# EAGLE design doorbellUSB (EAGLE 9.6.2)
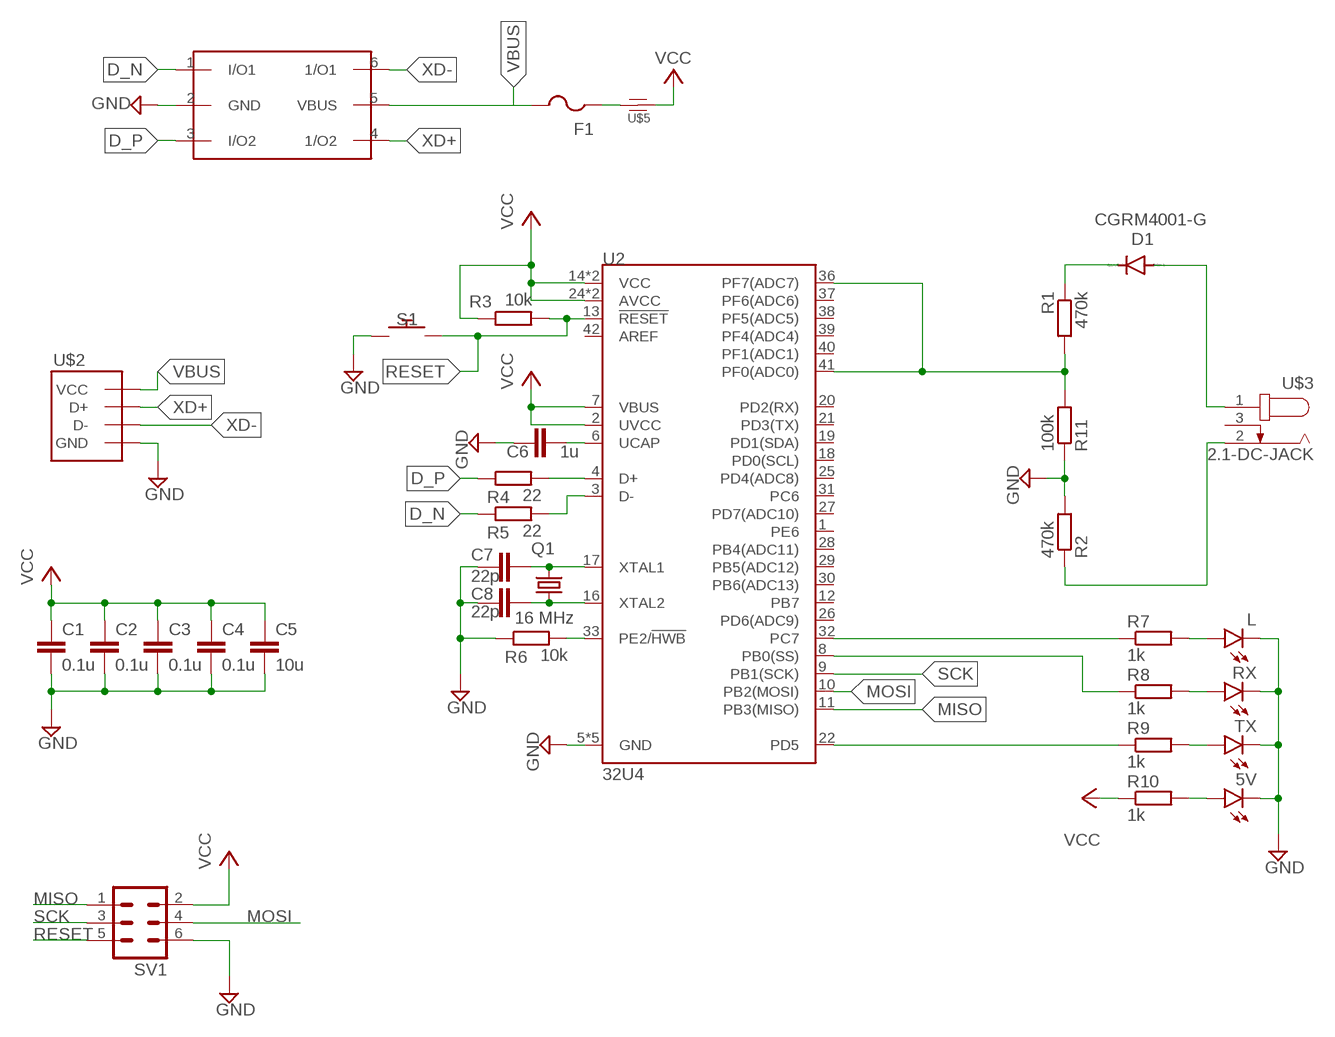
[diagram p0: schematic, sheet 1]

## Parts
5V  LEDCHIP-LED0805  [CHIP-LED0805]
C1  0.1u  C-EUC0805  [C0805]
C2  0.1u  C-EUC0805  [C0805]
C3  0.1u  C-EUC0805  [C0805]
C4  0.1u  C-EUC0805  [C0805]
C5  10u  C-EUC0805  [C0805]
C6  1u  C-EUC0805  [C0805]
C7  22p  C-EUC0805  [C0805]
C8  22p  C-EUC0805  [C0805]
D1  CGRM4001-G  [SOD-123_MINI-SMA]
F1  PTCFUSE-1812  [1812]
L  LEDCHIP-LED0805  [CHIP-LED0805]
Q1  16 MHz  KX-9B  [5.0X3.2_2]
R1  470k  R-EU_R0805  [R0805]
R2  470k  R-EU_R0805  [R0805]
R3  10k  R-EU_R0805  [R0805]
R4  22  R-EU_R0805  [R0805]
R5  22  R-EU_R0805  [R0805]
R6  10k  R-EU_R0805  [R0805]
R7  1k  R-EU_R0805  [R0805]
R8  1k  R-EU_R0805  [R0805]
R9  1k  R-EU_R0805  [R0805]
R10  1k  R-EU_R0805  [R0805]
R11  100k  R-EU_R0805  [R0805]
RX  LEDCHIP-LED0805  [CHIP-LED0805]
S1  3X4MM-PUHSBUTTON  [3X4MM-PUSHBUTTON]
SV1  MA03-2  [MA03-2]
TX  LEDCHIP-LED0805  [CHIP-LED0805]
U2  32U4  ATMEGA32U4TQFP-44  [TQFP44]
U$1  USBLC-2  [SOT23-6L]
U$2  PCB-USB-A  [USB-A-ONBOARD]
U$3  2.1-DC-JACK  [2.1X5.5MM_JACK]
U$5  FERRITE-BEAD  [R0805]

## Nets
D_N: R5.1 U$1.1(I/O1)
D_P: R4.1 U$1.3(I/O2)
DATA_N [diff pairs]: R5.2 U2.3(D-)
DATA_P [diff pairs]: R4.2 U2.4(D+)
GND: 5V.C C1.2 C2.2 C3.2 C4.2 C5.2 C6.1 C7.2 C8.2 L.C R2.2 R6.1 R11.1 RX.C S1.P$1 SV1.6 TX.C U2.5(GND) U2.15(GND) U2.23(GND) U2.35(GND) U2.43(GND) U$1.2(GND) U$2.GND
MISO: SV1.1 U2.11(PB3(MISO))
MOSI: SV1.4 U2.10(PB2(MOSI))
N$1: R2.1 U$3.2
N$2: D1.A U$3.1
N$3: D1.C R1.1
N$4: R1.2 R11.2 U2.36(PF7(ADC7)) U2.41(PF0(ADC0))
N$24: R8.1 U2.8(PB0(SS))
N$25: C6.2 U2.6(UCAP)
N$26: R9.1 U2.22(PD5)
N$27: R7.1 U2.32(PC7)
N$28: L.A R7.2
N$29: R9.2 TX.A
N$30: R6.2 U2.33(PE2/!HWB)
N$31: F1.1 U$5.2
N$32: R8.2 RX.A
N$33: 5V.A R10.2
RESET: R3.2 S1.P$2 SV1.5 U2.13(!RESET)
SCK: SV1.3 U2.9(PB1(SCK))
VBUS: F1.2 U$1.5(VBUS) U$2.VCC
VCC: C1.1 C2.1 C3.1 C4.1 C5.1 R3.1 R10.1 SV1.2 U2.2(UVCC) U2.7(VBUS) U2.14(VCC) U2.24(AVCC) U2.34(VCC) U2.44(AVCC) U$5.1
XD+ [diff pairs]: U$1.4(1/O2) U$2.D+
XD- [diff pairs]: U$1.6(1/O1) U$2.D-
XTAL_1: C8.1 Q1.1 U2.16(XTAL2)
XTAL_2: C7.1 Q1.2 U2.17(XTAL1)
Unconnected: U2.1(PE6) U2.12(PB7) U2.18(PD0(SCL)) U2.19(PD1(SDA)) U2.20(PD2(RX)) U2.21(PD3(TX)) U2.25(PD4(ADC8)) U2.26(PD6(ADC9)) U2.27(PD7(ADC10)) U2.28(PB4(ADC11)) U2.29(PB5(ADC12)) U2.30(PB6(ADC13)) U2.31(PC6) U2.37(PF6(ADC6)) U2.38(PF5(ADC5)) U2.39(PF4(ADC4)) U2.40(PF1(ADC1)) U2.42(AREF) U$3.3

## Library data of the parts
5V L RX TX = led:LED: LED OSRAM: - CHIPLED LG R971, LG N971, LY N971, LG Q971, LY Q971, LO R971, LY R971 LH N974, LH R974 LS Q976, LO Q976, LY Q976 LO Q996 - Hyper CHIPLED LW Q18S LB Q993, LB Q99A, LB R99A - SideLED LS A670, LO A670, LY A670, LG A670, LP A670 LB A673, LV A673, LT A673, LW A673 LH A674 LY A675 LS A676, LA A676, LO A676, LY A676, LW A676 LS A679, LY A679, LG A679 - Hyper Micro SIDELED® LS Y876, LA Y876, LO Y876, LY Y876 LT Y87S - SmartLED LW L88C, LW L88S LB L89C, LB L89S, LG L890 LS L89K, LO L89K, LY L89K LS L896, LA L896, LO L896, LY L896 - TOPLED LS T670, LO T670, LY T670, LG T670, LP T670 LSG T670, LSP T670, LSY T670, LOP T670, LYG T670 LG T671, LOG T671, LSG T671 LB T673, LV T673, LT T673, LW T673 LH T674 LS T676, LA T676, LO T676, LY T676, LB T676, LH T676, LSB T676, LW T676 LB T67C, LV T67C, LT T67C, LS T67K, LO T67K, LY T67K, LW E67C LS E67B, LA E67B, LO E67B, LY E67B, LB E67C, LV E67C, LT E67C LW T67C LS T679, LY T679, LG T679 LS T770, LO T770, LY T770, LG T770, LP T770 LB T773, LV T773, LT T773, LW T773 LH T774 LS E675, LA E675, LY E675, LS T675 LS T776, LA T776, LO T776, LY T776, LB T776 LHGB T686 LT T68C, LB T68C - Hyper Mini TOPLED® LB M676 - Mini TOPLED Santana® LG M470 LS M47K, LO M47K, LY M47K Source: http://www.osram.convergy.de LUXEON: - LUMILED® LXK2-PW12-R00, LXK2-PW12-S00, LXK2-PW14-U00, LXK2-PW14-V00 LXK2-PM12-R00, LXK2-PM12-S00, LXK2-PM14-U00 LXK2-PE12-Q00, LXK2-PE12-R00, LXK2-PE12-S00, LXK2-PE14-T00, LXK2-PE14-U00 LXK2-PB12-K00, LXK2-PB12-L00, LXK2-PB12-M00, LXK2-PB14-N00, LXK2-PB14-P00, LXK2-PB14-Q00 LXK2-PR12-L00, LXK2-PR12-M00, LXK2-PR14-Q00, LXK2-PR14-R00 LXK2-PD12-Q00, LXK2-PD12-R00, LXK2-PD12-S00 LXK2-PH12-R00, LXK2-PH12-S00 LXK2-PL12-P00, LXK2-PL12-Q00, LXK2-PL12-R00 Source: www.luxeon.com KINGBRIGHT: KA-3528ASYC Source: www.kingbright.com
C1-C8 = rcl:C-EU: CAPACITOR, European symbol; SPICEPREFIX: C
D1 = diode:CGRM400*-G: Molded plasitc,JEDEC SOD-123/Mini SMA Source: Comchip CGRM4001-G.pdf
F1 = adafruit:PTCFUSE: PTC fuses, resettable thermistors
Q1 = crystal-geyer_V1_0:KX: Quartz Crystals (MHz) SMD: KX - Serie Model Size l/w/h [mm] Frequency Range Frequency Stability Temp. Range [°C] Load Capacitance AECQ 200 availabel Datasheet KX-4 KX-5 KX-6 KX-7 KX-9A KX-9B KX-12A KX-12B KX-13 KX-20 KX-K KX-KS 1.6/1.2/0.3 2.0/1.6/0.45 2.5/2.0/0.55 3.2/2.5/0.8 5.0/3.2/1.0 5.0/3.2/1.1 6.0/3.5/1.1 6.0/3.5/1.0 7.0/5.0 /1.3 11.6/5.5/1.6 12.3/4.5/4.2 12.3/4.5/3.2 24.0 ~ 80.0 MHz 16.0 ~ 80.0 MHz 12.0 ~ 80.0 MHz 8.0 ~ 60.0 MHz 7,68 ~ 300,0 MHz 8,0 ~ 50,0 MHz 8,0 ~ 150,0 MHz 8,0 ~ 50,0 MHz 6,0 ~ 160,0 MHz 3,579 ~ 25,0 MHz 3,579 ~ 70,0 MHz 3,579 ~ 70,0 MHz ±10 … ±50ppm ±10 … ±50ppm ±10 … ±50ppm ±10 … ±50ppm ±10 … ±50ppm ±10 … ±50ppm ±10 … ±50ppm ±10 … ±50ppm ±10 … ±50ppm ±50ppm ±10 … ±50ppm ±10 … ±50ppm (*) -40°C …+85°C (*) -40°C …+125°C (*) -40°C …+125°C (*) -40°C …+125°C (*) -40°C …+105°C (*) -40°C …+105°C (*) -40°C …+125°C (*) -40°C …+105°C (*) -40°C …+105°C (*) -40°C …+105°C (*) -40°C …+85°C (*) -40°C …+85°C 8, 8…16 8, 8…16 10, 8…16 12, 7…20 16, 10…20 16, 10…20 16, 10…20 16, 12…20 16, 12…20 16, 12…20 16, 12…30 16, 12…30 - yes yes yes - - - - - - - - KX-4.pdf <http://www.geyer-electronic.de/uploads/tx_userartikelfrequenz/GEYER-KX-4.pdf> KX-5.pdf <http://www.geyer-electronic.de/uploads/tx_userartikelfrequenz/GEYER-KX-5.pdf> KX-6.pdf <http://www.geyer-electronic.de/uploads/tx_userartikelfrequenz/GEYER-KX-6.pdf> KX-7.pdf <http://www.geyer-electronic.de/uploads/tx_userartikelfrequenz/GEYER-KX-7.pdf> KX-9A.pdf <http://www.geyer-electronic.de/uploads/tx_userartikelfrequenz/GEYER-KX-9A.pdf> KX-9B.pdf <http://www.geyer-electronic.de/uploads/tx_userartikelfrequenz/GEYER-KX-9B.pdf> KX-12A.pdf <http://www.geyer-electronic.de/uploads/tx_userartikelfrequenz/GEYER-KX-12A.pdf> KX-12B.pdf <http://www.geyer-electronic.de/uploads/tx_userartikelfrequenz/GEYER-KX-12B.pdf> KX-13.pdf <http://www.geyer-electronic.de/uploads/tx_userartikelfrequenz/GEYER-KX-13.pdf> KX-20.pdf <http://www.geyer-electronic.de/uploads/tx_userartikelfrequenz/GEYER-KX-20.pdf> KX-K.pdf <http://www.geyer-electronic.de/uploads/tx_userartikelfrequenz/GEYER-KX-K.pdf> KX-KS.pdf <http://www.geyer-electronic.de/uploads/tx_userartikelfrequenz/GEYER-KX-KS.pdf> <http://www.geyer-electronic.de/fileadmin/template/img/logo-geyer-electronic.png> Details see: http://www.geyer-electronic.de/Frequenz-Produkte.9.0.html Created 2016-06-07, Hans Locher 2016 (C) Geyer Quartz Technology KX4,KX5,KX6,KX7,KX9A,KX9B,KX12A,KX12B,KX13,KX20,KXK,KXKS;1612;2016;2520;3225;5032;6035;7050;11655;12345;1,6x1,2;2,0x1,6;2,5x2,0;3,2x2,5;5,0x3,2;6,0x3,5;7,0x5,0;11,6x5,5;12,3x4,5;12,3x4,5;1.6x1.2;2.0x1.6;2.5x2.0;3.2x2.5;5.0x3.2;6.0x3.5;7.0x5.0;11.6x5.5;12.3x4.5;12.3x4.5;
R1-R11 = rcl:R-EU_: RESISTOR, European symbol; SPICEPREFIX: R
S1 = bidpl:3X4MM-PUHSBUTTON: https://ae01.alicdn.com/kf/HTB1vkExQpXXXXbFXFXXq6xXFXXXk/10PCS-2Pin-SMD-Mini-Button-Switch-Phone-Side-Push-3X4MM-Micro-Button-Switch-used-for-key.jpg_960x960.jpg
SV1 = bidpl:MA03-2: PIN HEADER
U2 = bidpl:ATMEGA32U4: Atmel MCU, 32KByte Atmel 44-pin 8-bit Microcontroller with 32KBytes of ISP Flash and USB Controller Datasheet <http://cdn.sparkfun.com/datasheets/Dev/Arduino/Boards/ATMega32U4.pdf> SparkFun Products LilyPad Arduino USB - ATmega32U4 Board <https://www.sparkfun.com/products/12049> (DEV-12049) Pro Micro - 5V/16MHz <https://www.sparkfun.com/products/12640> (DEV-12640) Pro Micro - 3.3V/8MHz <https://www.sparkfun.com/products/12587> (DEV-12587) Fio v3 - ATmega32U4 <https://www.sparkfun.com/products/11520> (DEV-11520) Qduino Mini <https://www.sparkfun.com/products/13614> (DEV-13614) Makey Makey - Standard Kit <https://www.sparkfun.com/products/11511> (WIG-11511) Makey Makey Deluxe Kit <https://www.sparkfun.com/products/11519> (WIG-11519); PROD_ID: IC-11161
U$1 = bidpl:USBLC-2: USB prot thingy https://www.mouser.com/datasheet/2/389/usblc6_2-1852789.pdf
U$2 = bidpl:PCB-USB-A
U$3 = bidpl:2.1-DC-JACK: https://www.digikey.com/en/products/detail/w%C3%BCrth-elektronik/694106301002/5047522?s=N4IgTCBcDaIGwE4AsBGADHAzG9aIF0BfIA
U$5 = bidpl:FERRITE-BEAD

## Board
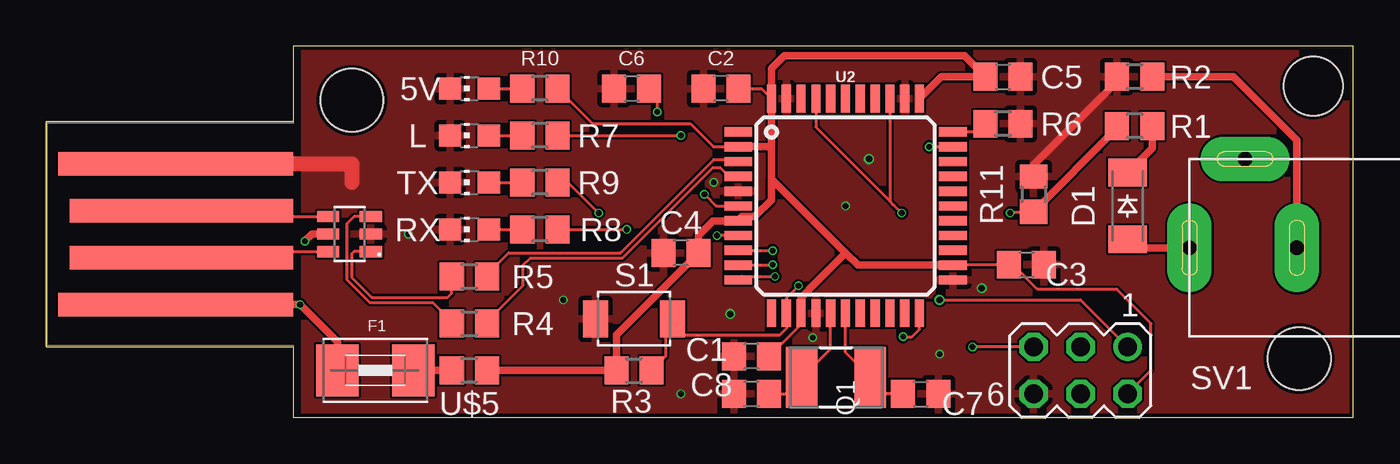
[diagram p1: board, top side]
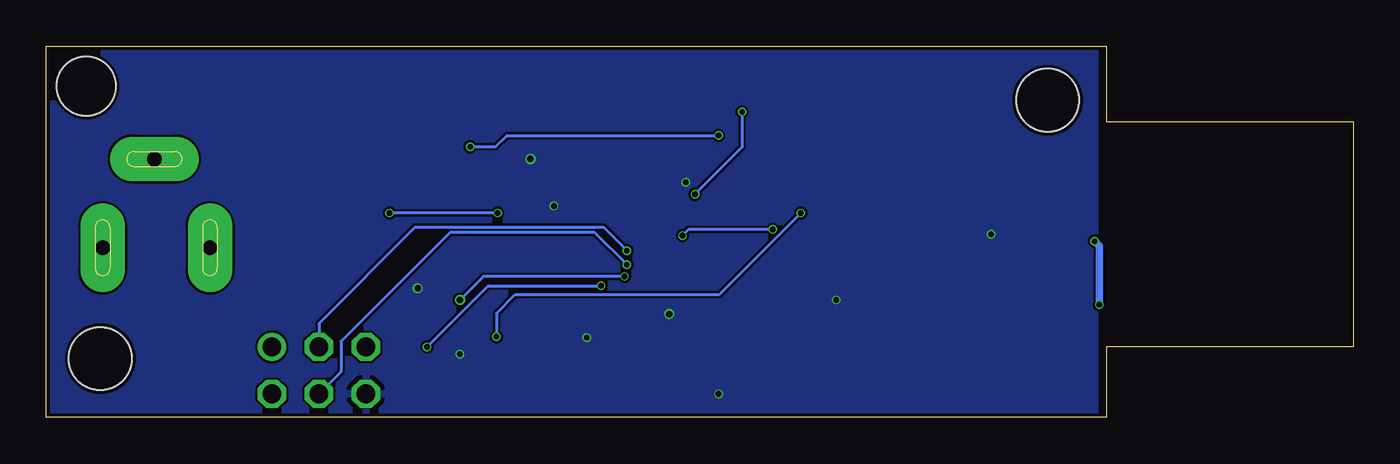
[diagram p2: board, bottom side, seen from below]

Size 70.61 x 20.07 mm. Coordinates in mm from the lower left corner, seen from the top.
Outline: 0,3.81 13.34,3.81 13.34,0 70.61,0 70.61,20.07 13.34,20.07 13.34,16 0,16 0,3.81
Copper layers (1*16): Top 0.035559375mm / dielectric 1.6mm / Bottom 0.035559375mm
Design rules "jlcpcb2layer": minimum track width 5mil, minimum drill 12mil, track to track 5mil, track to pad 5mil, pad to pad 5mil, via to via 5mil, smd to smd 5mil, copper to edge 8mil, drill to drill 6mil, minimum pad ring 5mil, minimum via ring 3mil, stop-mask expansion 2.5mil, vias tented up to drill 0mil, thermal gap 10mil
Holes 3.17 mm at 68.45,17.91
Holes 3.4 mm at 67.69,3.17 16.51,17.14

### Footprints (pad centres in the part's own frame; a part is rotated, then mirrored left to right if it is on the bottom)
CHIP-LED0805 = smd 1.2 x 1.2: A 0,-1.05; C 0,1.05
C0805 = smd 1.3 x 1.5: 1 -0.95,0; 2 0.95,0
SOD-123_MINI-SMA = smd 1.5 x 2.1: A 1.8,0; C -1.8,0
1812 = smd 2.286 x 2.794: 1 -2.046,0; 2 2.046,0
5.0X3.2_2 = smd 1.7 x 3.3: 1 -1.85,0; 2 1.85,0
R0805 = smd 1.3 x 1.5: 1 -0.95,0; 2 0.95,0
3X4MM-PUSHBUTTON = smd 1.35 x 2: P$1 -2.075,0; P$2 2.075,0
MA03-2 = drill 1.016: 1 -2.54,-1.27 | drill 1.016 octagon: 2 -2.54,1.27; 3 0,-1.27; 4 0,1.27; 5 2.54,-1.27; 6 2.54,1.27
TQFP44 = smd 1.5 x 0.5: 1 -5.8,4; 2 -5.8,3.2; 3 -5.8,2.4; 4 -5.8,1.6; 5 -5.8,0.8; 6 -5.8,0; 7 -5.8,-0.8; 8 -5.8,-1.6; 9 -5.8,-2.4; 10 -5.8,-3.2; 11 -5.8,-4; 23 5.8,-4; 24 5.8,-3.2; 25 5.8,-2.4; 26 5.8,-1.6; 27 5.8,-0.8; 28 5.8,0; 29 5.8,0.8; 30 5.8,1.6; 31 5.8,2.4; 32 5.8,3.2; 33 5.8,4 | smd 0.5 x 1.5: 12 -4,-5.8; 13 -3.2,-5.8; 14 -2.4,-5.8; 15 -1.6,-5.8; 16 -0.8,-5.8; 17 0,-5.8; 18 0.8,-5.8; 19 1.6,-5.8; 20 2.4,-5.8; 21 3.2,-5.8; 22 4,-5.8; 34 4,5.8; 35 3.2,5.8; 36 2.4,5.8; 37 1.6,5.8; 38 0.8,5.8; 39 0,5.8; 40 -0.8,5.8; 41 -1.6,5.8; 42 -2.4,5.8; 43 -3.2,5.8; 44 -4,5.8
SOT23-6L = smd 0.6 x 1.2: 1 -0.95,-1.15; 2 0,-1.15; 3 0.95,-1.15; 4 0.95,1.15; 5 0,1.15; 6 -0.95,1.15
USB-A-ONBOARD = smd 1.27 x 12.065: D+ 1.27,6.032; D- -1.27,6.032 | smd 1.27 x 12.7: GND 3.81,6.35; VCC -3.81,6.35
2.1X5.5MM_JACK = drill 0.8 pad 2.4 long: 1 3,4.8; 2 -2.8,4.8; 3 0,0

### Placement (x,y rotation side)
5V  22.86,17.78 90 top
C1  38.1,3.3 180 top
C2  36.45,17.78 180 top
C3  52.96,8.26 0 top
C4  34.29,8.89 180 top
C5  51.69,18.41 0 top
C6  31.62,17.78 0 top
C7  47.24,1.27 0 top
C8  38.1,1.27 180 top
D1  58.42,11.43 270 top
F1  17.78,2.54 180 top
L  22.86,15.24 90 top
Q1  42.67,2.16 0 top
R1  58.8,15.75 180 top
R2  58.8,18.41 180 top
R3  31.75,2.54 0 top
R4  22.86,5.08 0 top
R5  22.86,7.62 0 top
R6  51.69,15.88 180 top
R7  26.67,15.24 180 top
R8  26.67,10.16 180 top
R9  26.67,12.7 180 top
R10  26.67,17.78 180 top
R11  53.34,12.06 270 top
RX  22.86,10.16 90 top
S1  31.75,5.33 0 top
SV1  55.88,2.54 180 top
TX  22.86,12.7 90 top
U2  43.18,11.43 0 top
U$1  16.38,9.91 90 top
U$2  13.34,9.91 90 top
U$3  64.77,13.97 180 top
U$5  22.86,2.54 180 top

### Tracks (layer width: path | path; a pad name or v marks a point on that pad's centre or on a via)
D_N
  Top 0.152: U$1.1 16.63,8.96 16.51,8.84 16.51,7.57 17.59,6.49 21.69,6.49 21.91,6.71 R5.1
D_P
  Top 0.152: U$1.3 16.63,10.86 16.23,10.46 16.23,7.45 17.47,6.21 20.88,6.21 21.91,5.18 R4.1
DATA_N
  Top 0.152: U2.3 37.26,13.95 36.07,13.95 31.02,8.89 24.98,8.89 23.81,7.72 R5.2
DATA_P
  Top 0.152: U2.4 36.88,13.03 36.41,13.5 36.02,13.5 31.13,8.61 26.15,8.61 25.77,8.23 25.77,7.14 23.81,5.18 R4.2
GND  (via drill 0.3, 0.35)
  Top 0.406: R11.1 53.34,13.65 57.85,18.16 R2.2
  Top 0.813: U$2.GND 16.51,13.72 16.51,12.7
  other vias: 48.26,3.43 19.56,9.91 43.18,11.43 27.94,6.35 34.29,1.27 41.4,4.32 36.07,12.7 50.55,6.99 36.96,5.59 44.45,13.97
  pour Top: 13.97,-1.27 76.2,-1.27 77.47,0 77.47,22.86 76.2,24.13 13.97,24.13
  pour Bottom: 13.97,27.94 13.97,-3.81 80.01,-3.81 80.01,27.94
MISO  (via drill 0.3, 0.35)
  Top 0.152: U2.11 37.57,7.62 v39.37,7.62 | v48.26,6.35 55.88,6.35 SV1.1
  Bottom 0.152: v39.37,7.62 46.99,7.62 v48.26,6.35
MOSI  (via drill 0.3)
  Top 0.152: U2.10 39.22,8.23 v39.24,8.26
  Bottom 0.152: SV1.4 54.69,2.46 54.69,4.12 48.79,10.01 41,10.01 v39.24,8.26
N$1
  Top 0.406: U$3.2 67.57,14.98 64.14,18.41 R2.1
N$2
  Top 0.406: D1.A 58.88,9.17 U$3.1
N$3
  Top 0.406: D1.C 59.75,14.56 R1.1
N$4  (via drill 0.3)
  Top 0.152: U2.41 41.58,15.7 45.58,11.7 | v52.07,11.05 52.14,11.12 R11.2 | v46.23,11.05 45.78,11.49 45.58,11.7 | U2.36 45.58,11.7
  Top 0.406: R11.2 57.85,15.63 R1.2
  Bottom 0.152: v46.23,11.05 v52.07,11.05
N$24  (via drill 0.3)
  Top 0.152: R8.1 v31.37,10.16 | U2.8 v36.24,9.83
  Bottom 0.152: v31.37,10.16 35.91,10.16 v36.24,9.83
N$25  (via drill 0.3)
  Top 0.152: v33.02,16.51 33.02,17.33 C6.2 | v35.56,12.06 36.2,11.43 U2.6
  Bottom 0.152: v33.02,16.51 33.02,14.61 v35.56,12.06
N$26  (via drill 0.3)
  Top 0.152: R9.1 28.19,12.7 v29.84,11.05 | v46.29,4.36 46.78,4.36 47.18,4.76 U2.22
  Bottom 0.152: v29.84,11.05 34.25,6.65 45.27,6.65 46.29,5.63 v46.29,4.36
N$27  (via drill 0.3)
  Top 0.152: R7.1 v34.29,15.24 | v47.71,14.63 U2.32
  Bottom 0.152: v34.29,15.24 45.72,15.24 46.33,14.63 v47.71,14.63
N$28
  Top 0.152: L.A R7.2
N$29
  Top 0.152: TX.A R9.2
N$30
  Top 0.152: R6.2 50.29,15.43 U2.33
N$31
  Top 0.406: F1.1 U$5.2
N$32
  Top 0.152: RX.A R8.2
N$33
  Top 0.152: 5V.A R10.2
RESET  (via drill 0.3)
  Top 0.152: R3.2 33.46,3.3 33.46,4.97 S1.P$2 33.83,4.83 34.21,4.45 39.62,4.45 39.98,4.8 U2.13 39.98,6.45 v40.64,7.11 | SV1.5 v50.04,3.81
  Bottom 0.152: v50.04,3.81 46.74,7.11 v40.64,7.11
SCK  (via drill 0.3)
  Top 0.152: U2.9 v39.23,9.03 v39.24,9.02
  Bottom 0.152: v39.24,9.02 40.51,10.29 50.67,10.29 55.88,5.08 SV1.3
VBUS  (via drill 0.3)
  Top 0.406: U$2.VCC v13.72,6.1 15.73,4.08 F1.2 | v13.97,9.53 14.35,9.91 U$1.5
  Bottom 0.406: v13.97,9.53 13.72,9.27 v13.72,6.1
VCC
  Top 0.152: C1.1 40.78,5.03 U2.14 | C3.1 51.98,8.23 | 51.98,8.23 U2.24 | R10.1 29.52,15.88 34.8,15.88 36.04,14.63 U2.2 | C2.1 38.63,17.78 U2.44 | SV1.2 59.69,2.54 59.69,5.08 57.85,6.92 53.56,6.92 52.25,8.23 51.98,8.23
  Top 0.406: U$5.1 R3.1 30.8,4.45 33.01,6.66 C4.1 35.24,9.84 36.03,10.63 U2.7 37.6,10.85 38.27,10.85 39.18,11.76 39.18,12.89 | 43.18,8.89 41.2,6.91 41.2,6.88 40.78,6.46 U2.14 | U2.24 43.84,8.23 43.18,8.89 | 43.18,8.89 39.18,12.89 | 39.18,14.48 U2.44 39.18,18.86 39.88,19.56 49.6,19.56 C5.1 48.37,18.41 U2.34 | 39.18,14.48 39.18,12.89 | U2.2 39.03,14.63 39.18,14.48
XD+
  Top 0.152: U$2.D+ 7.62,10.86 U$1.4
XD-
  Top 0.152: U$2.D- 7.62,8.96 U$1.6
XTAL_1
  Top 0.152: C8.1 39.93,1.27 Q1.1 42.38,3.72 U2.16
XTAL_2
  Top 0.152: C7.1 45.41,1.27 Q1.2 43.18,3.5 U2.17